# Altium schematic sheet 3_DAC.schdoc.schdoc
size 431 x 309 mm; Symbol: Sheet-Symbol_A4; Device: Sheet-Symbol_A4; Company: 嘉立创EDA; Version: V1.0; Page Size: A4; @Project Name: 偏控器件; @Page Count: 5; @Update Date: 2025-09-26; @Create Date: 2025-09-19; @Schematic Name: Schematic1; @Page No: 3; @Page Name: DAC
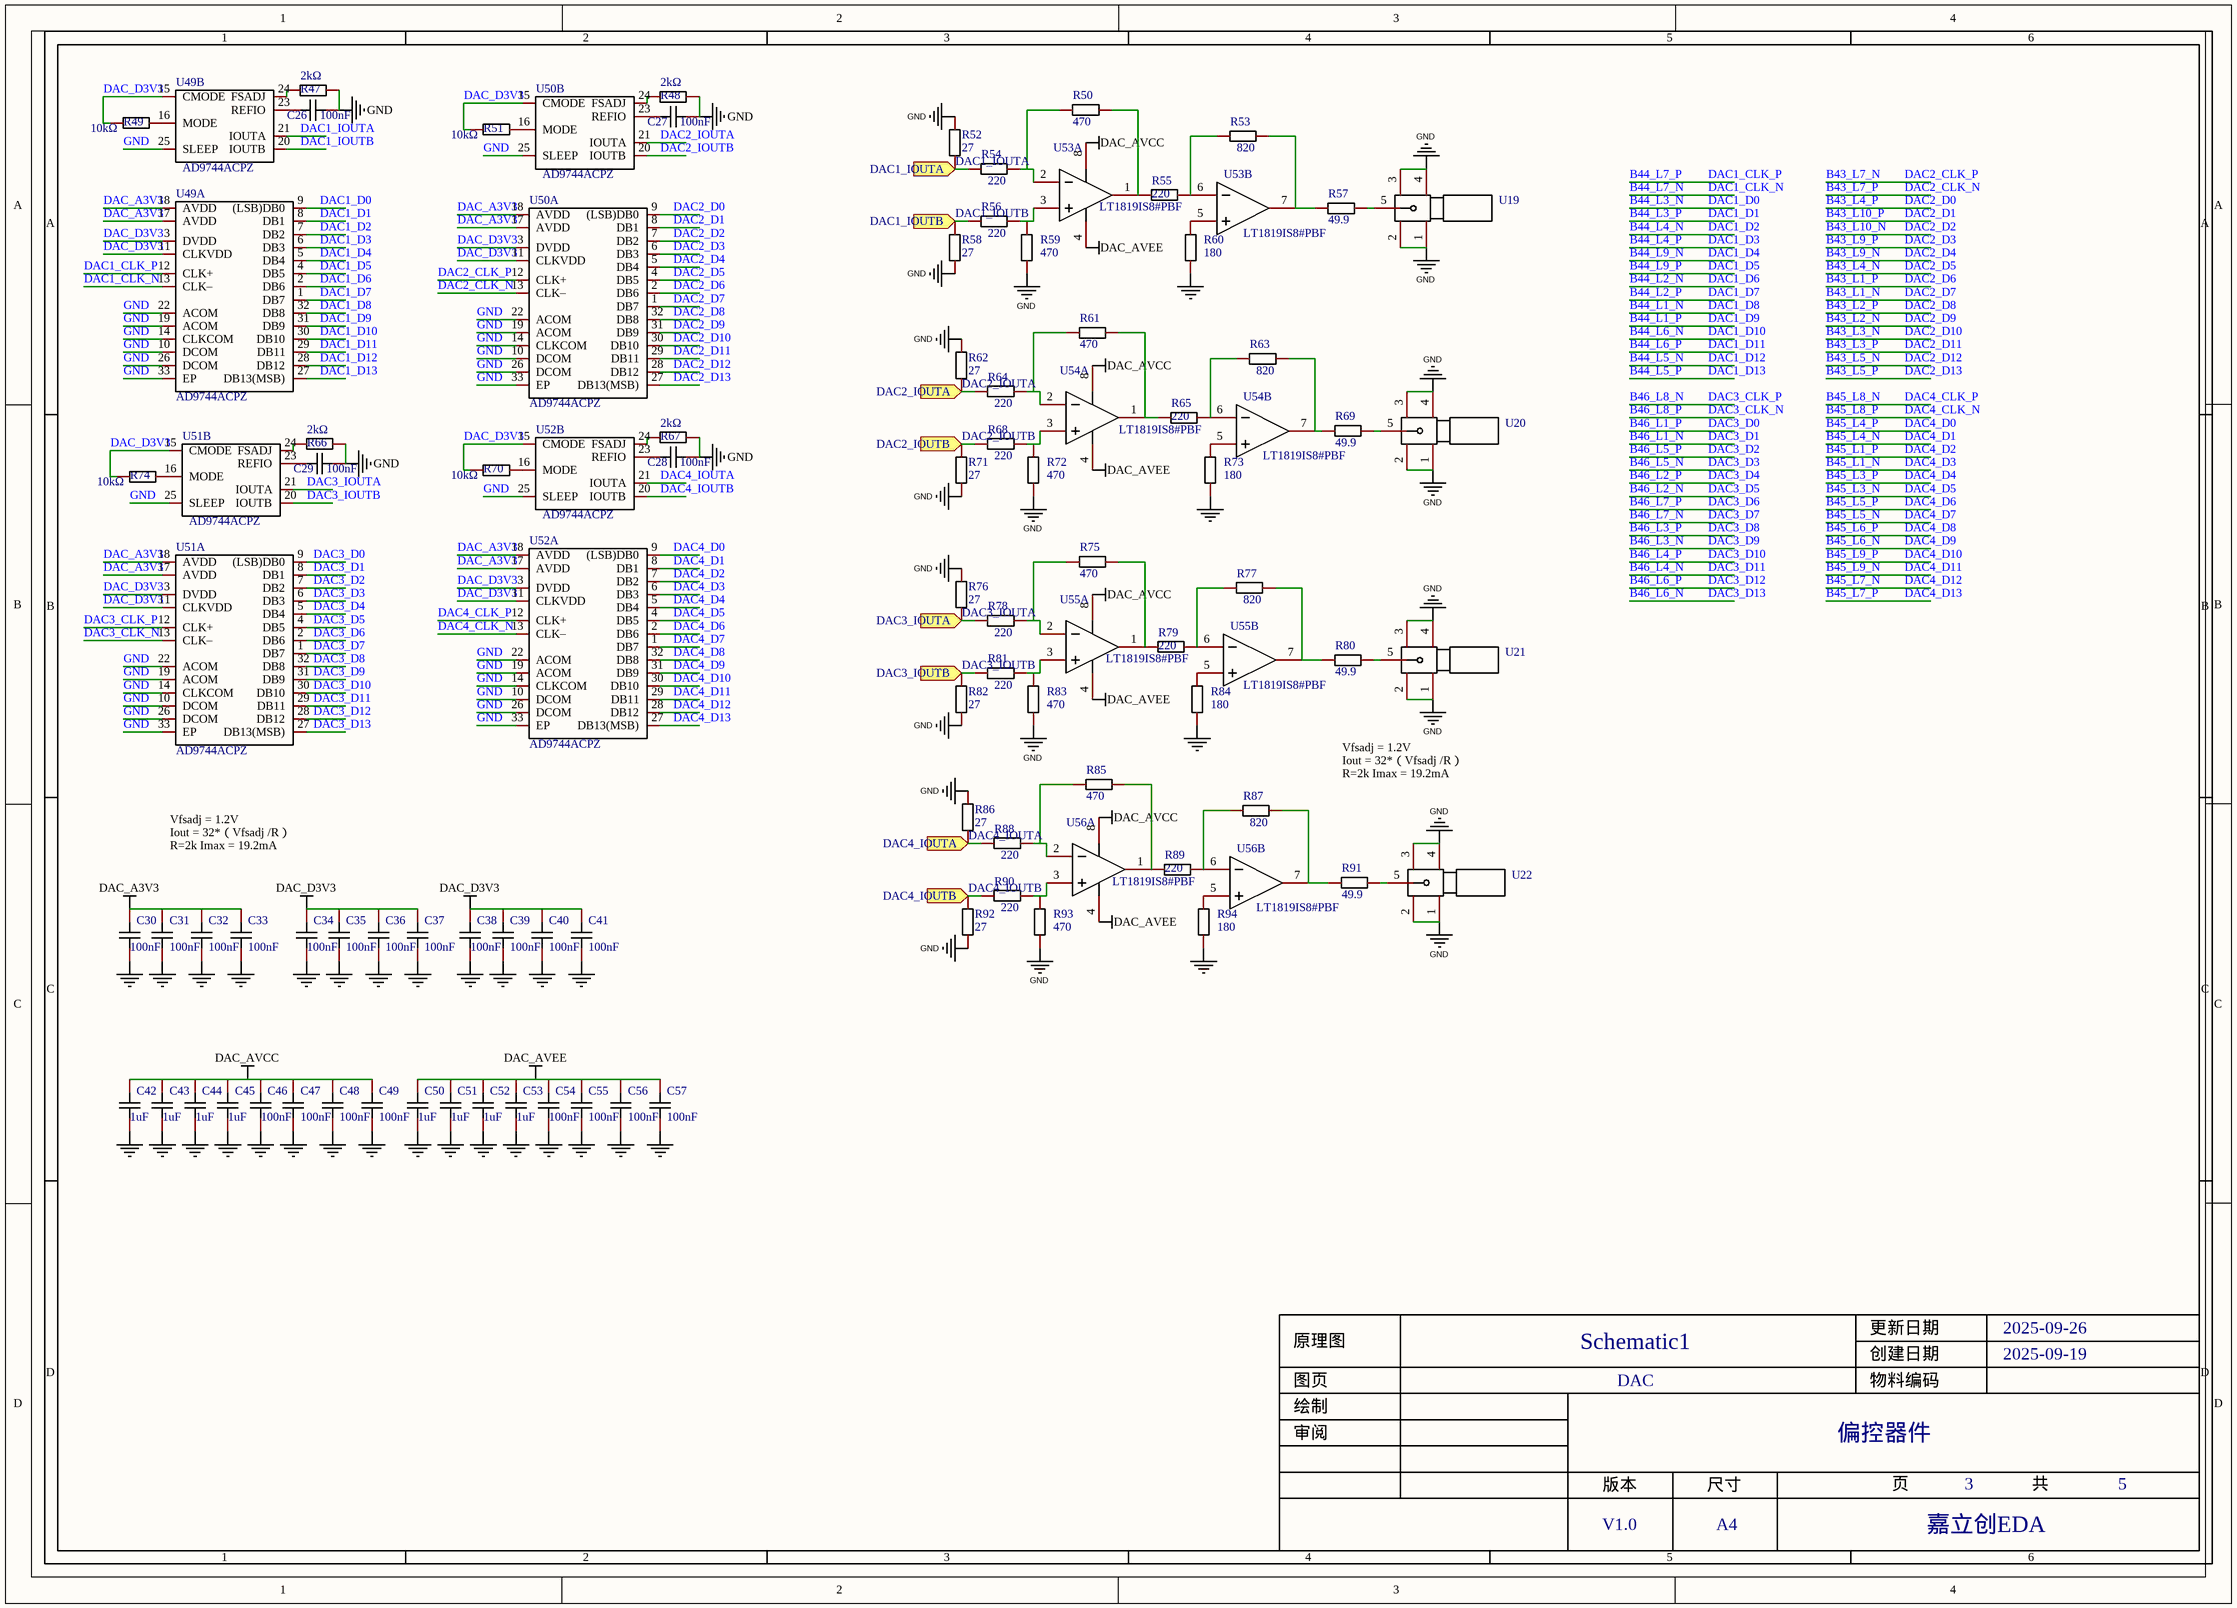
[diagram p0: 3_DAC.schdoc.schdoc]

## Parts
C26  100nF  [C0402]
C27  100nF  [C0402]
C28  100nF  [C0402]
C29  100nF  [C0402]
C30  100nF  [C0402]
C31  100nF  [C0402]
C32  100nF  [C0402]
C33  100nF  [C0402]
C34  100nF  [C0402]
C35  100nF  [C0402]
C36  100nF  [C0402]
C37  100nF  [C0402]
C38  100nF  [C0402]
C39  100nF  [C0402]
C40  100nF  [C0402]
C41  100nF  [C0402]
C42  1uF  [C0603]
C43  1uF  [C0603]
C44  1uF  [C0603]
C45  1uF  [C0603]
C46  100nF  [C0402]
C47  100nF  [C0402]
C48  100nF  [C0402]
C49  100nF  [C0402]
C50  1uF  [C0603]
C51  1uF  [C0603]
C52  1uF  [C0603]
C53  1uF  [C0603]
C54  100nF  [C0402]
C55  100nF  [C0402]
C56  100nF  [C0402]
C57  100nF  [C0402]
R47  2kΩ  [R0402]
R48  2kΩ  [R0402]
R49  10kΩ  [R0402]
R50  470  [R0402]
R51  10kΩ  [R0402]
R52  27  [R0402]
R53  820  [R0402]
R54  220  [R0402]
R55  220  [R0402]
R56  220  [R0402]
R57  49.9  [R0603]
R58  27  [R0402]
R59  470  [R0402]
R60  180  [R0402]
R61  470  [R0402]
R62  27  [R0402]
R63  820  [R0402]
R64  220  [R0402]
R65  220  [R0402]
R66  2kΩ  [R0402]
R67  2kΩ  [R0402]
R68  220  [R0402]
R69  49.9  [R0603]
R70  10kΩ  [R0402]
R71  27  [R0402]
R72  470  [R0402]
R73  180  [R0402]
R74  10kΩ  [R0402]
R75  470  [R0402]
R76  27  [R0402]
R77  820  [R0402]
R78  220  [R0402]
R79  220  [R0402]
R80  49.9  [R0603]
R81  220  [R0402]
R82  27  [R0402]
R83  470  [R0402]
R84  180  [R0402]
R85  470  [R0402]
R86  27  [R0402]
R87  820  [R0402]
R88  220  [R0402]
R89  220  [R0402]
R90  220  [R0402]
R91  49.9  [R0603]
R92  27  [R0402]
R93  470  [R0402]
R94  180  [R0402]
U19  MOLEX_SMA  [MOLEX_SMA]  (value not drawn)
U20  MOLEX_SMA  [MOLEX_SMA]  (value not drawn)
U21  MOLEX_SMA  [MOLEX_SMA]  (value not drawn)
U22  MOLEX_SMA  [MOLEX_SMA]  (value not drawn)
U49  AD9744ACPZ  [LFCSP-32_L5.0-W5.0-P0.50-TL-EP3.1]  (parts A,B of 2)
U50  AD9744ACPZ  [LFCSP-32_L5.0-W5.0-P0.50-TL-EP3.1]  (parts A,B of 2)
U51  AD9744ACPZ  [LFCSP-32_L5.0-W5.0-P0.50-TL-EP3.1]  (parts A,B of 2)
U52  AD9744ACPZ  [LFCSP-32_L5.0-W5.0-P0.50-TL-EP3.1]  (parts A,B of 2)
U53  LT1819IS8#PBF  [SOP-8_L5.0-W4.0-P1.27-LS6.0-BL]  (parts A,B of 2)
U54  LT1819IS8#PBF  [SOP-8_L5.0-W4.0-P1.27-LS6.0-BL]  (parts A,B of 2)
U55  LT1819IS8#PBF  [SOP-8_L5.0-W4.0-P1.27-LS6.0-BL]  (parts A,B of 2)
U56  LT1819IS8#PBF  [SOP-8_L5.0-W4.0-P1.27-LS6.0-BL]  (parts A,B of 2)

## Ports
DAC1_IOUTA (in), DAC1_IOUTB (in), DAC2_IOUTA (in), DAC2_IOUTB (in), DAC3_IOUTA (in), DAC3_IOUTB (in), DAC4_IOUTA (in), DAC4_IOUTB (in)

## Nets
DAC_A3V3: C30.2 C31.2 C32.2 C33.2 U49.17(AVDD) U49.18(AVDD) U50.17(AVDD) U50.18(AVDD) U51.17(AVDD) U51.18(AVDD) U52.17(AVDD) U52.18(AVDD)
DAC_AVCC: C42.2 C43.2 C44.2 C45.2 C46.2 C47.2 C48.2 C49.2 U53.8(VCC) U54.8(VCC) U55.8(VCC) U56.8(VCC)
DAC_AVEE: C50.2 C51.2 C52.2 C53.2 C54.2 C55.2 C56.2 C57.2 U53.4(GND) U54.4(GND) U55.4(GND) U56.4(GND)
DAC_D3V3: C34.2 C35.2 C36.2 C37.2 C38.2 C39.2 C40.2 C41.2 R49.2 R51.2 R70.2 R74.2 U49.3(DVDD) U49.11(CLKVDD) U49.15(CMODE) U50.3(DVDD) U50.11(CLKVDD) U50.15(CMODE) U51.3(DVDD) U51.11(CLKVDD) U51.15(CMODE) U52.3(DVDD) U52.11(CLKVDD) U52.15(CMODE)
GND: C26.2 C27.2 C28.2 C29.2 C30.1 C31.1 C32.1 C33.1 C34.1 C35.1 C36.1 C37.1 C38.1 C39.1 C40.1 C41.1 C42.1 C43.1 C44.1 C45.1 C46.1 C47.1 C48.1 C49.1 C50.1 C51.1 C52.1 C53.1 C54.1 C55.1 C56.1 C57.1 R47.2 R48.2 R52.2 R58.1 R59.2 R60.2 R62.2 R66.2 R67.2 R71.1 R72.2 R73.2 R76.2 R82.1 R83.2 R84.2 R86.2 R92.1 R93.2 R94.2 U19.1 U19.2 U19.3 U19.4 U20.1 U20.2 U20.3 U20.4 U21.1 U21.2 U21.3 U21.4 U22.1 U22.2 U22.3 U22.4 U49.10(DCOM) U49.14(CLKCOM) U49.19(ACOM) U49.22(ACOM) U49.25(SLEEP) U49.26(DCOM) U49.33(EP) U50.10(DCOM) U50.14(CLKCOM) U50.19(ACOM) U50.22(ACOM) U50.25(SLEEP) U50.26(DCOM) U50.33(EP) U51.10(DCOM) U51.14(CLKCOM) U51.19(ACOM) U51.22(ACOM) U51.25(SLEEP) U51.26(DCOM) U51.33(EP) U52.10(DCOM) U52.14(CLKCOM) U52.19(ACOM) U52.22(ACOM) U52.25(SLEEP) U52.26(DCOM) U52.33(EP)
B43_L1_N: U50.1(DB7)  [also labelled DAC2_D7]
B43_L1_P: U50.2(DB6)  [also labelled DAC2_D6]
B43_L2_N: U50.31(DB9)  [also labelled DAC2_D9]
B43_L2_P: U50.32(DB8)  [also labelled DAC2_D8]
B43_L3_N: U50.30(DB10)  [also labelled DAC2_D10]
B43_L3_P: U50.29(DB11)  [also labelled DAC2_D11]
B43_L4_N: U50.4(DB5)  [also labelled DAC2_D5]
B43_L4_P: U50.9((LSB)DB0)  [also labelled DAC2_D0]
B43_L5_N: U50.28(DB12)  [also labelled DAC2_D12]
B43_L5_P: U50.27(DB13(MSB))  [also labelled DAC2_D13]
B43_L7_N: U50.12(CLK+)  [also labelled DAC2_CLK_P]
B43_L7_P: U50.13(CLK–)  [also labelled DAC2_CLK_N]
B43_L9_N: U50.5(DB4)  [also labelled DAC2_D4]
B43_L9_P: U50.6(DB3)  [also labelled DAC2_D3]
B43_L10_N: U50.7(DB2)  [also labelled DAC2_D2]
B43_L10_P: U50.8(DB1)  [also labelled DAC2_D1]
B44_L1_N: U49.32(DB8)  [also labelled DAC1_D8]
B44_L1_P: U49.31(DB9)  [also labelled DAC1_D9]
B44_L2_N: U49.2(DB6)  [also labelled DAC1_D6]
B44_L2_P: U49.1(DB7)  [also labelled DAC1_D7]
B44_L3_N: U49.9((LSB)DB0)  [also labelled DAC1_D0]
B44_L3_P: U49.8(DB1)  [also labelled DAC1_D1]
B44_L4_N: U49.7(DB2)  [also labelled DAC1_D2]
B44_L4_P: U49.6(DB3)  [also labelled DAC1_D3]
B44_L5_N: U49.28(DB12)  [also labelled DAC1_D12]
B44_L5_P: U49.27(DB13(MSB))  [also labelled DAC1_D13]
B44_L6_N: U49.30(DB10)  [also labelled DAC1_D10]
B44_L6_P: U49.29(DB11)  [also labelled DAC1_D11]
B44_L7_N: U49.13(CLK–)  [also labelled DAC1_CLK_N]
B44_L7_P: U49.12(CLK+)  [also labelled DAC1_CLK_P]
B44_L9_N: U49.5(DB4)  [also labelled DAC1_D4]
B44_L9_P: U49.4(DB5)  [also labelled DAC1_D5]
B45_L1_N: U52.6(DB3)  [also labelled DAC4_D3]
B45_L1_P: U52.7(DB2)  [also labelled DAC4_D2]
B45_L3_N: U52.4(DB5)  [also labelled DAC4_D5]
B45_L3_P: U52.5(DB4)  [also labelled DAC4_D4]
B45_L4_N: U52.8(DB1)  [also labelled DAC4_D1]
B45_L4_P: U52.9((LSB)DB0)  [also labelled DAC4_D0]
B45_L5_N: U52.1(DB7)  [also labelled DAC4_D7]
B45_L5_P: U52.2(DB6)  [also labelled DAC4_D6]
B45_L6_N: U52.31(DB9)  [also labelled DAC4_D9]
B45_L6_P: U52.32(DB8)  [also labelled DAC4_D8]
B45_L7_N: U52.28(DB12)  [also labelled DAC4_D12]
B45_L7_P: U52.27(DB13(MSB))  [also labelled DAC4_D13]
B45_L8_N: U52.12(CLK+)  [also labelled DAC4_CLK_P]
B45_L8_P: U52.13(CLK–)  [also labelled DAC4_CLK_N]
B45_L9_N: U52.29(DB11)  [also labelled DAC4_D11]
B45_L9_P: U52.30(DB10)  [also labelled DAC4_D10]
B46_L1_N: U51.8(DB1)  [also labelled DAC3_D1]
B46_L1_P: U51.9((LSB)DB0)  [also labelled DAC3_D0]
B46_L2_N: U51.4(DB5)  [also labelled DAC3_D5]
B46_L2_P: U51.5(DB4)  [also labelled DAC3_D4]
B46_L3_N: U51.31(DB9)  [also labelled DAC3_D9]
B46_L3_P: U51.32(DB8)  [also labelled DAC3_D8]
B46_L4_N: U51.29(DB11)  [also labelled DAC3_D11]
B46_L4_P: U51.30(DB10)  [also labelled DAC3_D10]
B46_L5_N: U51.6(DB3)  [also labelled DAC3_D3]
B46_L5_P: U51.7(DB2)  [also labelled DAC3_D2]
B46_L6_N: U51.27(DB13(MSB))  [also labelled DAC3_D13]
B46_L6_P: U51.28(DB12)  [also labelled DAC3_D12]
B46_L7_N: U51.1(DB7)  [also labelled DAC3_D7]
B46_L7_P: U51.2(DB6)  [also labelled DAC3_D6]
B46_L8_N: U51.12(CLK+)  [also labelled DAC3_CLK_P]
B46_L8_P: U51.13(CLK–)  [also labelled DAC3_CLK_N]
DAC1_IOUTA: R52.1 R54.2 U49.21(IOUTA) ; port DAC1_IOUTA
DAC1_IOUTB: R56.2 R58.2 U49.20(IOUTB) ; port DAC1_IOUTB
DAC2_IOUTA: R62.1 R64.2 U50.21(IOUTA) ; port DAC2_IOUTA
DAC2_IOUTB: R68.2 R71.2 U50.20(IOUTB) ; port DAC2_IOUTB
DAC3_IOUTA: R76.1 R78.2 U51.21(IOUTA) ; port DAC3_IOUTA
DAC3_IOUTB: R81.2 R82.2 U51.20(IOUTB) ; port DAC3_IOUTB
DAC4_IOUTA: R86.1 R88.2 U52.21(IOUTA) ; port DAC4_IOUTA
DAC4_IOUTB: R90.2 R92.2 U52.20(IOUTB) ; port DAC4_IOUTB
NetC26_1: C26.1 U49.23(REFIO)
NetC27_1: C27.1 U50.23(REFIO)
NetC28_1: C28.1 U52.23(REFIO)
NetC29_1: C29.1 U51.23(REFIO)
NetR47_1: R47.1 U49.24(FSADJ)
NetR48_1: R48.1 U50.24(FSADJ)
NetR49_1: R49.1 U49.16(MODE)
NetR50_1: R50.1 R55.2 U53.1(OUT1)
NetR50_2: R50.2 R54.1 U53.2(IN1-)
NetR51_1: R51.1 U50.16(MODE)
NetR53_1: R53.1 R57.1 U53.7(OUT2)
NetR53_2: R53.2 R55.1 U53.6(IN2-)
NetR56_1: R56.1 R59.1 U53.3(IN1+)
NetR57_2: R57.2 U19.5
NetR60_1: R60.1 U53.5(IN2+)
NetR61_1: R61.1 R65.2 U54.1(OUT1)
NetR61_2: R61.2 R64.1 U54.2(IN1-)
NetR63_1: R63.1 R69.1 U54.7(OUT2)
NetR63_2: R63.2 R65.1 U54.6(IN2-)
NetR66_1: R66.1 U51.24(FSADJ)
NetR67_1: R67.1 U52.24(FSADJ)
NetR68_1: R68.1 R72.1 U54.3(IN1+)
NetR69_2: R69.2 U20.5
NetR70_1: R70.1 U52.16(MODE)
NetR73_1: R73.1 U54.5(IN2+)
NetR74_1: R74.1 U51.16(MODE)
NetR75_1: R75.1 R79.2 U55.1(OUT1)
NetR75_2: R75.2 R78.1 U55.2(IN1-)
NetR77_1: R77.1 R80.1 U55.7(OUT2)
NetR77_2: R77.2 R79.1 U55.6(IN2-)
NetR80_2: R80.2 U21.5
NetR81_1: R81.1 R83.1 U55.3(IN1+)
NetR84_1: R84.1 U55.5(IN2+)
NetR85_1: R85.1 R89.2 U56.1(OUT1)
NetR85_2: R85.2 R88.1 U56.2(IN1-)
NetR87_1: R87.1 R91.1 U56.7(OUT2)
NetR87_2: R87.2 R89.1 U56.6(IN2-)
NetR90_1: R90.1 R93.1 U56.3(IN1+)
NetR91_2: R91.2 U22.5
NetR94_1: R94.1 U56.5(IN2+)

## Notes on the sheet
- (near U22) Vfsadj = 1.2V
  Iout = 32*（Vfsadj /R）
  R=2k Imax = 19.2mA
- Vfsadj = 1.2V
  Iout = 32*（Vfsadj /R）
  R=2k Imax = 19.2mA
- 1
- 2
- 3
- 4
- 5
- 6
- A
- B
- C
- D
- 原理图
- Schematic1
- 创建日期
- 更新日期
- 2025-09-26
- 2025-09-19
- 审阅
- 绘制
- 图页
- DAC
- 物料编码
- 偏控器件
- 版本
- 尺寸
- 页
- 共
- V1.0
- A4
- 嘉立创EDA

## Library data of the parts
C26-C41 C46-C49 C54-C57 = GRM155R71H104KE14D: Manufacturer: muRata(村田); Add into BOM: yes; Tolerance: ±10%; Voltage Rated: 50V; Temperature Coefficient: X7R; Description: 容值:100nF;精度:±10%;额定电压:50V;材质(温度系数):X7R;; Name: 100nF; Symbol: GRM155R71H104KE14D; Device: GRM155R71H104KE14D; LCSC Part Name: 100nF ±10% 50V; Supplier Part: C77020; Manufacturer Part: GRM155R71H104KE14D; Supplier Footprint: 0402; JLCPCB Part Class: 扩展库; Datasheet: https://atta.szlcsc.com/upload/public/pdf/source/20180326/C77020_39BD49C951FF1AF0DB1F1FAC5AC1E401.pdf; Supplier: LCSC; Convert to PCB: yes; Value: 100nF
C42-C45 C50-C53 = CC0603KRX7R9BB105: Manufacturer: YAGEO(国巨); Add into BOM: yes; Tolerance: ±10%; Voltage Rating: 50V; Temperature Coefficient: X7R; Description: 容值:1uF;精度:±10%;额定电压:50V;温度系数:X7R;; Name: 1uF; Symbol: CC0603KRX7R9BB105; Device: CC0603KRX7R9BB105; LCSC Part Name: 1uF ±10% 50V; Supplier Part: C559769; Manufacturer Part: CC0603KRX7R9BB105; Supplier Footprint: 0603; JLCPCB Part Class: 扩展库; Datasheet: https://item.szlcsc.com/datasheet/CC0603KRX7R9BB105/584032.html; Supplier: LCSC; Convert to PCB: yes; Value: 1uF
R47-R49 R51 R66 R67 R70 R74 = 0402WGF1001TCE: Manufacturer: UNI-ROYAL(厚声); Add into BOM: yes; Tolerance: ±1%; Power(Watts): 62.5mW; Temperature Coefficient: ±100ppm/℃; Overload Voltage (Max): 50V; Description: 电阻类型:厚膜电阻;阻值:1kΩ;精度:±1%;功率:62.5mW;; Symbol: 0402WGF1001TCE; Device: 0402WGF1001TCE; LCSC Part Name: 1kΩ ±1% 62.5mW; Supplier Part: C11702; Manufacturer Part: 0402WGF1001TCE; Supplier Footprint: 0402; JLCPCB Part Class: Basic Part; Datasheet: https://atta.szlcsc.com/upload/public/pdf/source/20200306/C422600_1E6D84923E4A46A82E41ADD87F860B5C.pdf; Supplier: LCSC; Convert to PCB: yes; Type: 厚膜电阻; Operating Temperature Range: -55℃~+155℃
  R47 R48 R66 R67: Name: 2kΩ; Value: 2kΩ
  R49 R51 R70 R74: Name: 10kΩ; Value: 10kΩ
R50 R52-R56 R58-R65 R68 R71-R73 R75-R79 R81-R90 R92-R94 = Res_0402: Symbol: 电阻; Convert to PCB: yes; Device: Res_0402; Add into BOM: yes; Supplier Footprint: 0402
  R50 R59 R61 R72 R75 R83 R85 R93: Name: 470; Value: 470
  R52 R58 R62 R71 R76 R82 R86 R92: Name: 27; Value: 27
  R53 R63 R77 R87: Name: 820; Value: 820
  R54-R56 R64 R65 R68 R78 R79 R81 R88-R90: Name: 220; Value: 220
  R60 R73 R84 R94: Name: 180; Value: 180
R57 R69 R80 R91 = Res_0603: Symbol: 电阻; Convert to PCB: yes; Name: 49.9; Device: Res_0603; Add into BOM: yes; Supplier Footprint: 0603; Value: 49.9
U19-U22 = MOLEX_SMA: Add into BOM: yes; Description: C296128; Symbol: MOLEX_SMA; Device: MOLEX_SMA; Convert to PCB: yes
U49-U52 = AD9744ACPZ: Manufacturer: ADI(亚德诺); Add into BOM: yes; Interface: 并行; Resolution: 14位; Output Type: 电流-非缓冲; Settling Time: 11ns; Integral nonlinearity: ±0.5LSB；±0.8LSB; Supply Voltage: 2.7V~3.6V; Description: 接口:并行;分辨率:14位;稳定时间:11ns;INL/DNL:±0.5LSB；±0.8LSB;电源电压:2.7V~3.6V;; Name: AD9744ACPZ; Symbol: AD9744ACPZ; Device: AD9744ACPZ; Supplier: LCSC; Supplier Part: C653767; Manufacturer Part: AD9744ACPZ; JLCPCB Part Class: 扩展库; LCSC Part Name: AD9744ACPZ; Supplier Footprint: LFCSP-32; Datasheet: https://atta.szlcsc.com/upload/public/pdf/source/20191122/C461519_0CE66F4EB669333EDB67C039F6406F90.pdf; Convert to PCB: yes; Operating Temperature: -40℃~+85℃
U53-U56 = LT1819IS8#PBF: Manufacturer: ADI(亚德诺); Add into BOM: yes; Number of Circuits: 双路; Maximum Power Supply Range (Vdd-Vss): 10V; Gain Bandwidth Product(GBP): 400MHz; Voltage - Input Offset(Vos): 1.5mV; Input Offset Voltage Drift (Vos TC): 30uV/℃; Slew Rate(SR): 2500V/us; Current - Input Bias(Ib): 2uA; Noise density(eN): 6nV/√Hz@10kHz; Common Mode Rejection Ratio (CMRR): 85dB; Output Current: 70mA; Description: 放大器数:双路;轨到轨:-;增益带宽积(GBP):400MHz;输入失调电压(Vos):1.5mV;压摆率(SR):2500V/us;输入偏置电流(Ib):2uA;; Name: LT1819IS8#PBF; Symbol: LT1819IS8#PBF; Device: LT1819IS8#PBF; LCSC Part Name: 400MHz、2500V/us、9mA 双通道运算放大器; Supplier Part: C665487; Manufacturer Part: LT1819IS8#PBF; Supplier Footprint: SOP-8; JLCPCB Part Class: 扩展库; Datasheet: https://atta.szlcsc.com/upload/public/pdf/source/20200629/C665474_545359778D1078CAA837BDA2F2E5E456.pdf; Supplier: LCSC; Convert to PCB: yes; Rail to Rail: -; Operating Temperature: -40℃~+85℃